# EAGLE design indoor-air-quality-shield (EAGLE 7.1.0)
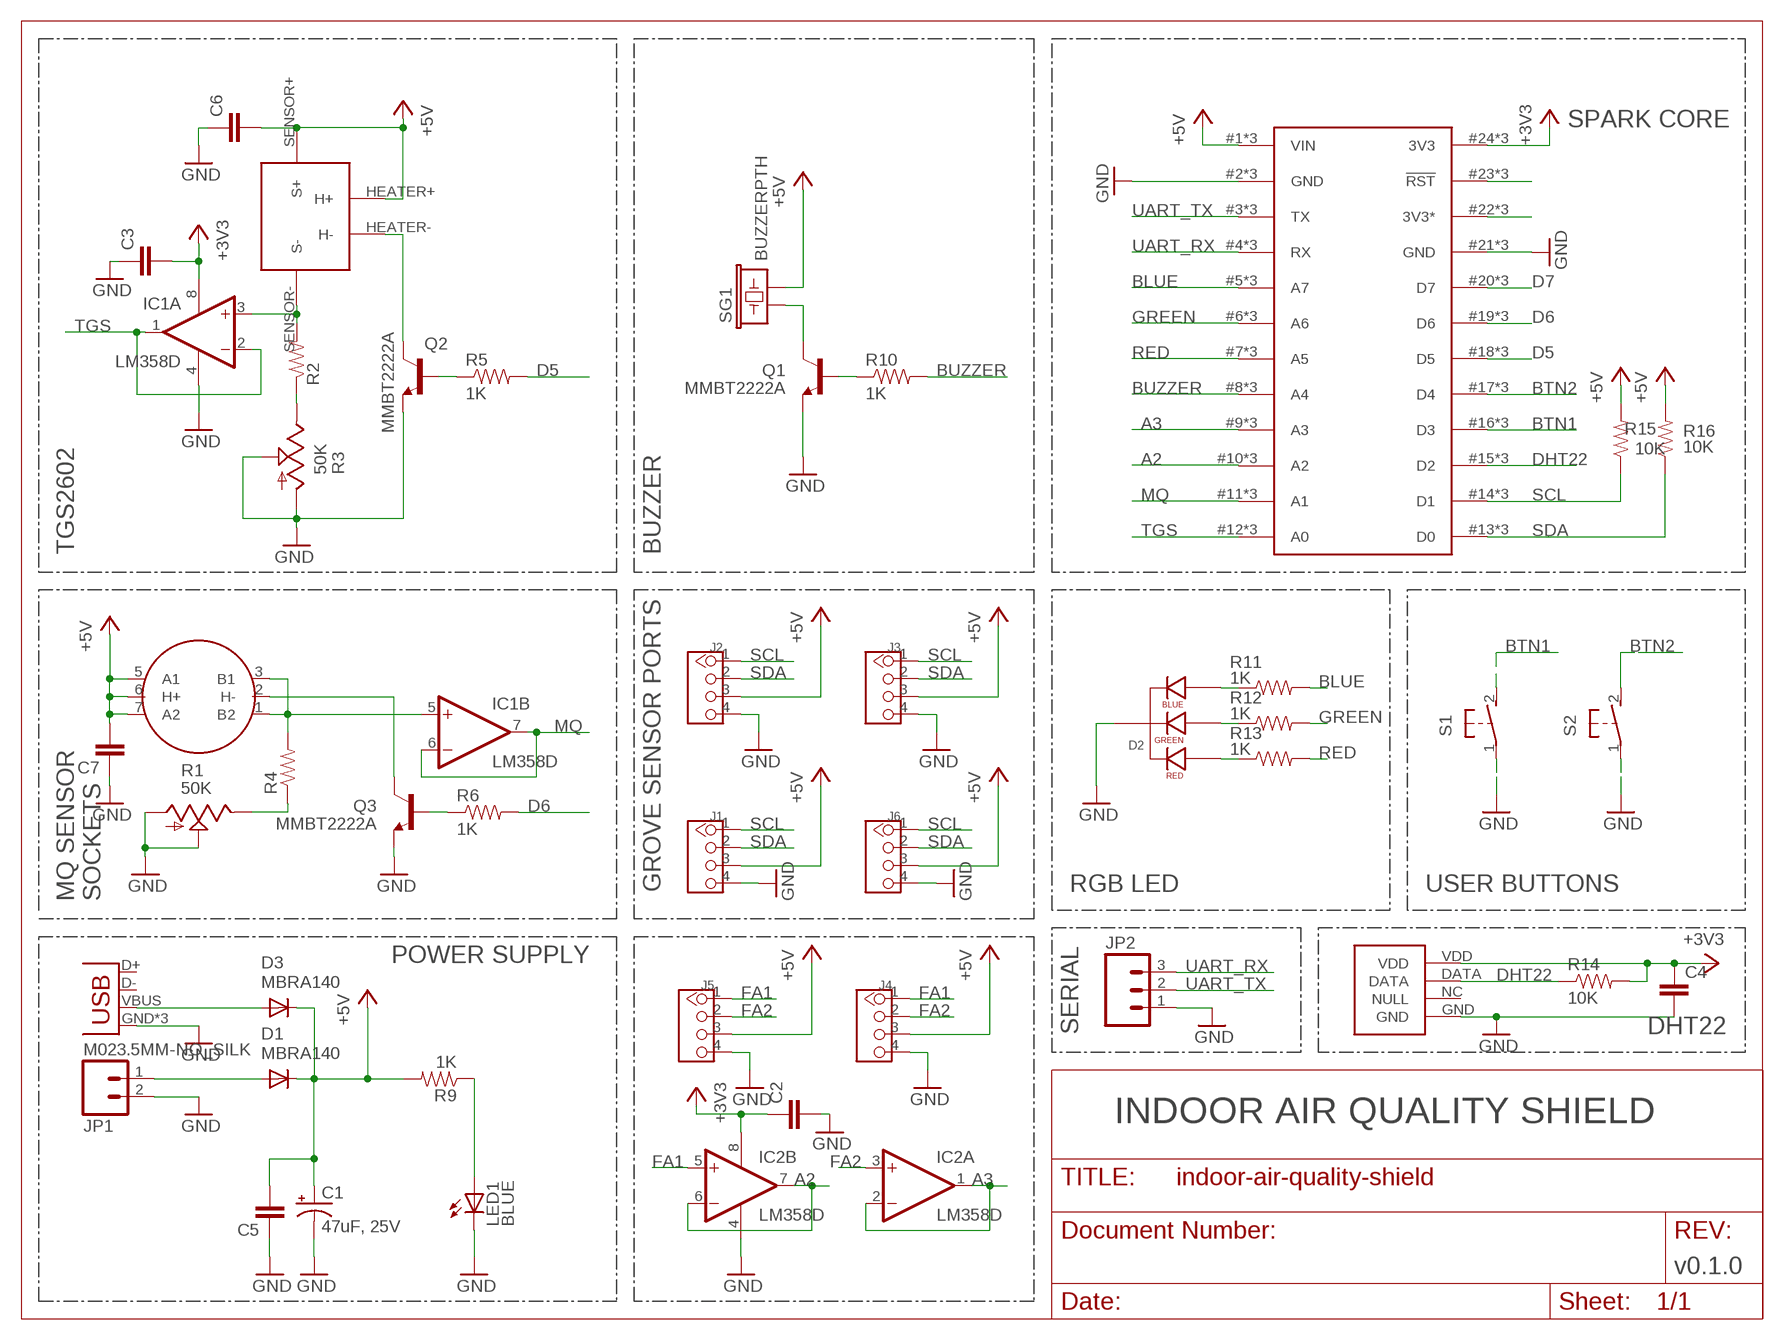
[diagram p0: schematic, sheet 1]

## Parts
C1  47uF, 25V  CAP_POLD  [PANASONIC_D]
C2  C-EUC0603  [C0603]
C3  C-EUC0603  [C0603]
C4  C-EUC0603  [C0603]
C5  C-EUC0603  [C0603]
C6  C-EUC0603  [C0603]
C7  C-EUC0603  [C0603]
D1  MBRA140  DIODESMA  [SMA-DIODE]
D2  LED-RGB-CC-THRUCLEAR  [LED-RGB-THRU]
D3  MBRA140  DIODESMA  [SMA-DIODE]
IC1  LM358D  [SO08]
IC2  LM358D  [SO08]
J1  TWIG-4P-2.0'D90'  [4P-2.0-90D-W/O-BUCKLE]
J2  TWIG-4P-2.0'D90'  [4P-2.0-90D-W/O-BUCKLE]
J3  TWIG-4P-2.0'D90'  [4P-2.0-90D-W/O-BUCKLE]
J4  TWIG-4P-2.0'D90'  [4P-2.0-90D-W/O-BUCKLE]
J5  TWIG-4P-2.0'D90'  [4P-2.0-90D-W/O-BUCKLE]
J6  TWIG-4P-2.0'D90'  [4P-2.0-90D-W/O-BUCKLE]
JP1  M023.5MM-NO_SILK  [SCREWTERMINAL-3.5MM-2-NS]
JP2  M03PTH  [1X03]
JP3  USBUSB-MICROB-SLOT-HOLE  [USB-MICROB-SLOT-HOLE]
LED1  BLUE  LED0603  [LED-0603]
Q1  MMBT2222A  TRANSISTOR_NPNMMBT2222A  [SOT23-3]
Q2  MMBT2222A  TRANSISTOR_NPNMMBT2222A  [SOT23-3]
Q3  MMBT2222A  TRANSISTOR_NPNMMBT2222A  [SOT23-3]
R1  50K  TRIM_US-RJ9W  [RJ9W]
R2  RESISTOR0603  [0603-RES]
R3  50K  TRIM_US-RJ9W  [RJ9W]
R4  RESISTOR0603  [0603-RES]
R5  1K  RESISTOR0603-RES  [0603-RES]
R6  1K  RESISTOR0603-RES  [0603-RES]
R9  1K  RESISTOR0603-RES  [0603-RES]
R10  1K  RESISTOR0603-RES  [0603-RES]
R11  1K  RESISTOR0603-RES  [0603-RES]
R12  1K  RESISTOR0603-RES  [0603-RES]
R13  1K  RESISTOR0603-RES  [0603-RES]
R14  10K  RESISTOR0603-RES  [0603-RES]
R15  10K  RESISTOR0603-RES  [0603-RES]
R16  10K  RESISTOR0603-RES  [0603-RES]
S1  31-XX  [B3F-31XX]
S2  31-XX  [B3F-31XX]
SG1  BUZZERPTH  [BUZZER-12MM]
U$1  TGS2602  [TGS2602]
U$2  MQ_SENSOR_SOCKET  [MQ_SENSOR_SOCKET]
U$5  DHT22  [DHT22]
U$6  SPARK_CORE  [SPARK_CORE_STACKABLE]

## Nets
+3V3: C2.1 C3.2 C4.1 IC1.8(P:V+) IC2.8(P:V+) R14.2 U$5.VDD U$6.24(3V3) U$6.#24(3V3) U$6.@24(3V3)
+5V: C1.+ C5.2 C6.2 C7.2 D1.C D3.C J1.3 J2.3 J3.3 J4.3 J5.3 J6.3 R9.2 R15.2 R16.2 SG1.- U$1.HEATER+(H+) U$1.SENSOR+(S+) U$2.5(A1) U$2.6(H+) U$2.7(A2) U$6.1(VIN) U$6.#1(VIN) U$6.@1(VIN)
A2: IC2.6(B:-IN) IC2.7(B:OUT) U$6.10(A2) U$6.#10(A2) U$6.@10(A2)
A3: IC2.1(A:OUT) IC2.2(A:-IN) U$6.9(A3) U$6.#9(A3) U$6.@9(A3)
BLUE: R11.2 U$6.5(A7) U$6.#5(A7) U$6.@5(A7)
BTN1: S1.2(S) U$6.16(D3) U$6.#16(D3) U$6.@16(D3)
BTN2: S2.2(S) U$6.17(D4) U$6.#17(D4) U$6.@17(D4)
BUZZER: R10.2 U$6.8(A4) U$6.#8(A4) U$6.@8(A4)
D5: R5.2 U$6.18(D5) U$6.#18(D5) U$6.@18(D5)
D6: R6.2 U$6.19(D6) U$6.#19(D6) U$6.@19(D6)
D7: U$6.20(D7) U$6.#20(D7) U$6.@20(D7)
DHT22: R14.1 U$5.DATA U$6.15(D2) U$6.#15(D2) U$6.@15(D2)
FA1: IC2.5(B:+IN) J4.1 J5.1
FA2: IC2.3(A:+IN) J4.2 J5.2
GND: C1.- C2.2 C3.1 C4.2 C5.1 C6.1 C7.1 D2.2(CATHODE) IC1.4(P:V-) IC2.4(P:V-) J1.4 J2.4 J3.4 J4.4 J5.4 J6.4 JP1.2 JP2.1 JP3.GND JP3.MT1(GND) JP3.MT2(GND) LED1.C Q1.2(E) Q2.2(E) Q3.2(E) R1.A R1.S R3.A R3.S S1.1(P) S2.1(P) U$5.GND U$6.2(GND) U$6.21(GND) U$6.#2(GND) U$6.#21(GND) U$6.@2(GND) U$6.@21(GND)
GREEN: R12.2 U$6.6(A6) U$6.#6(A6) U$6.@6(A6)
MQ: IC1.6(B:-IN) IC1.7(B:OUT) U$6.11(A1) U$6.#11(A1) U$6.@11(A1)
N$1: D2.4(BLUE_CATHODE) R11.1
N$2: D2.3(GREEN_CATHODE) R12.1
N$3: D2.1(RED_CATHODE) R13.1
N$4: R2.1 R3.E
N$5: U$6.23(!RST) U$6.#23(!RST) U$6.@23(!RST)
N$6: D1.A JP1.1
N$7: Q3.3(C) U$2.2(H-)
N$8: R1.E R4.1
N$9: U$6.22(3V3*) U$6.#22(3V3*) U$6.@22(3V3*)
N$10: D3.A JP3.VBUS
N$11: IC1.3(A:+IN) R2.2 U$1.SENSOR-(S-)
N$14: Q3.1(B) R6.1
N$15: Q1.1(B) R10.1
N$16: LED1.A R9.1
N$17: Q1.3(C) SG1.+
N$18: Q2.3(C) U$1.HEATER-(H-)
N$19: Q2.1(B) R5.1
N$23: IC1.5(B:+IN) R4.2 U$2.1(B2) U$2.3(B1)
RED: R13.2 U$6.7(A5) U$6.#7(A5) U$6.@7(A5)
SCL: J1.1 J2.1 J3.1 J6.1 R15.1 U$6.14(D1) U$6.#14(D1) U$6.@14(D1)
SDA: J1.2 J2.2 J3.2 J6.2 R16.1 U$6.13(D0) U$6.#13(D0) U$6.@13(D0)
TGS: IC1.1(A:OUT) IC1.2(A:-IN) U$6.12(A0) U$6.#12(A0) U$6.@12(A0)
UART_RX: JP2.3 U$6.4(RX) U$6.#4(RX) U$6.@4(RX)
UART_TX: JP2.2 U$6.3(TX) U$6.#3(TX) U$6.@3(TX)
Unconnected: JP3.D+ JP3.D- U$5.NC(NULL)

## Notes on the sheet
- SPARK CORE
- TGS2602 | BUZZER
- GROVE SENSOR PORTS | RGB LED | USER BUTTONS
- MQ SENSOR
  SOCKETS
- POWER SUPPLY
- SERIAL | DHT22
- INDOOR AIR QUALITY SHIELD
- v0.1.0

## Library data of the parts
C1 = SparkFun-Capacitors:CAP_POL: Capacitor Polarized These are standard SMD and PTH capacitors. Normally 10uF, 47uF, and 100uF in electrolytic and tantalum varieties. Always verify the external diameter of the through hole cap, it varies with capacity, voltage, and manufacturer. The EIA devices should be standard.
C2-C7 = rcl:C-EU: CAPACITOR, European symbol
D1 D3 = SparkFun-DiscreteSemi:DIODE: Diode These are standard reverse protection diodes and small signal diodes. SMA package can handle up to about 1A. SOD-323 can handle about 200mA. What the SOD-323 package when ordering, there are some mfgs out there that are 5-pin packages.
D2 = SparkFun-LED:LED-RGB-CC-THRU: RGB Through-hole common cathode LED SparkFun Storefront: COM-00105 (Clear) COM-09264 (Diffuse); PROD_ID: DIO-08418
IC1 IC2 = linear:LM358: OP AMP also LM158; LM258; LM2904 Source: http://cache.national.com/ds/LM/LM158.pdf
J1-J6 = Connector:TWIG-4P-2.0
JP1 = SparkFun-Connectors:M02: Standard 2-pin 0.1" header. Use with - straight break away headers ( PRT-00116) - right angle break away headers (PRT-00553) - swiss pins (PRT-00743) - machine pins (PRT-00117) - female headers (PRT-00115) Molex polarized connector foot print use with: PRT-08233 with associated crimp pins and housings. 2.54_SCREWTERM for use with PRT-10571. 3.5mm Screw Terminal footprints for PRT-08084 5mm Screw Terminal footprints for use with PRT-08433
JP2 = SparkFun-Connectors:M03: Header 3 Standard 3-pin 0.1" header. Use with straight break away headers (SKU : PRT-00116), right angle break away headers (PRT-00553), swiss pins (PRT-00743), machine pins (PRT-00117), and female headers (PRT-00115). Molex polarized connector foot print use with SKU : PRT-08232 with associated crimp pins and housings.
JP3 = Spark:USB
LED1 = SparkFun-LED:LED: LEDs Standard schematic elements and footprints for 5mm, 3mm, 1206, and 0603 sized LEDs. 5mm - Spark Fun Electronics SKU : COM-00529 (and others)
Q1-Q3 = SparkFun-DiscreteSemi:TRANSISTOR_NPN: Generic NPN BJT MMBT2222A - TRANS-08049 (SOT-23, 1A 40V) MPSA42 - TRANS-09116 (SOT-23, 500mA 300V) MMBT5088LT1G - TRANS-11160 (SOT-23, 50 mA 30V); PROD_ID: TRANS-08049
R1 R3 = pot:TRIM_US-: POTENTIOMETER
R2 R4 = SparkFun-Resistors:RESISTOR: Resistor Basic schematic elements and footprints for 0603, 1206, and PTH resistors.
R5 R6 R9-R16 = SparkFun-Passives:RESISTOR: Resistor Basic schematic elements and footprints for 0603, 1206, and PTH resistors.
S1 S2 = switch-omron:31-XX: OMRON SWITCH; MPN: B3F-3100; OC_FARNELL: 959704; OC_NEWARK: 36M3582
SG1 = SparkFun-Electromechanical:BUZZER: Buzzer 12mm Spark Fun Electronics SKU : Comp-Buzzer
U$1 = Spark:TGS2602
U$2 = Spark:MQ_SENSOR_SOCKET
U$5 = Spark:DHT22
U$6 = Spark:SPARK_CORE

## Board
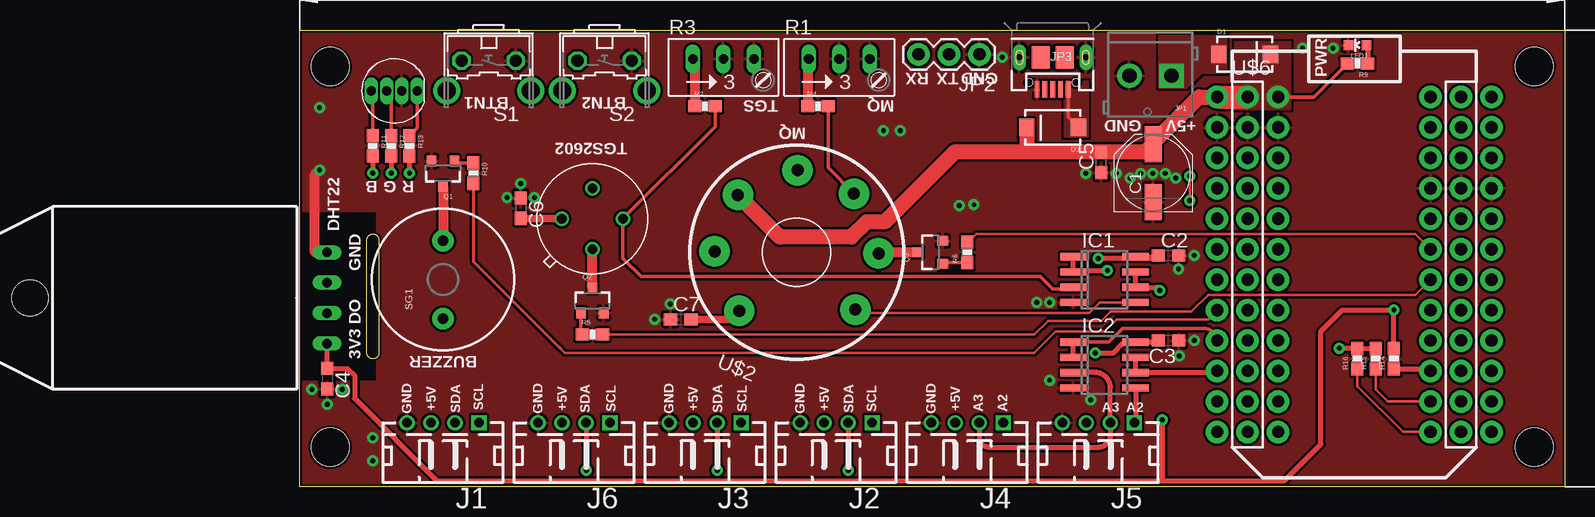
[diagram p1: board, top side]
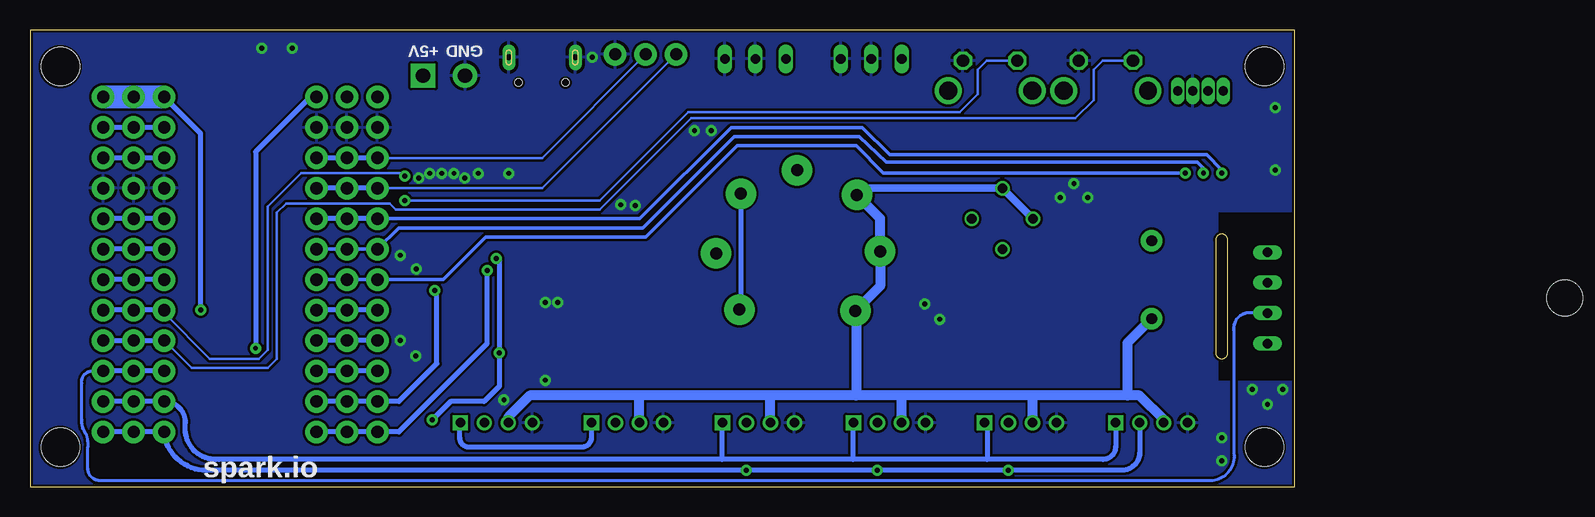
[diagram p2: board, bottom side, seen from below]

Size 105.41 x 38.1 mm. Coordinates in mm from the lower left corner, seen from the top.
Outline: 105.41,38.1 105.41,0 0,0 0,38.1 105.41,38.1
Outline: 5.59,11.18 5.59,20.57 arc-90 6.1,21.08 arc-90 6.6,20.57 6.6,11.18 arc-90 6.1,10.67 arc-90 5.59,11.18
Copper layers (1*16): Top 0.035mm / dielectric 1.5mm / Bottom 0.035mm
Design rules "SparkFun-2-layer *": minimum track width 7mil, minimum drill 15mil, track to track 8mil, track to pad 8mil, pad to pad 8mil, via to via 8mil, smd to smd 8mil, copper to edge 8mil, drill to drill 8mil, minimum pad ring 6mil, minimum via ring 10mil, stop-mask expansion 4mil, vias tented up to drill 20mil, thermal gap 10mil
Holes 3.17 mm at 2.54,35.05 102.87,3.3 2.54,3.3 102.87,35.05
tRestrict: area 0,8.9 to 6.3,22.9
bRestrict: area 0,8.9 to 6.3,22.9

### Footprints (pad centres in the part's own frame; a part is rotated, then mirrored left to right if it is on the bottom)
PANASONIC_D = smd 3 x 1.4: + 2.4,0; - -2.4,0
C0603 = smd 1.1 x 1: 1 -0.85,0; 2 0.85,0
SMA-DIODE = smd 1.27 x 1.47: A -2.15,0; C 2.15,0
LED-RGB-THRU = drill 0.762 pad 0.889 long: 1 1.905,0; 2 0.635,0; 3 -0.635,0; 4 -1.905,0
SO08 = smd 0.6 x 2.2: 1 -1.905,-2.6; 2 -0.635,-2.6; 3 0.635,-2.6; 4 1.905,-2.6; 5 1.905,2.6; 6 0.635,2.6; 7 -0.635,2.6; 8 -1.905,2.6
4P-2.0-90D-W/O-BUCKLE = drill 0.8 pad 1.27 square: 1 -3,0 | drill 0.8 pad 1.27: 2 -1,0; 3 1,0; 4 3,0
SCREWTERMINAL-3.5MM-2-NS = drill 1.2 pad 2.032 square: 1 0,0 | drill 1.2 pad 2.032: 2 3.5,0
1X03 = drill 1.016 pad 1.88: 1 0,0; 2 2.54,0; 3 5.08,0
USB-MICROB-SLOT-HOLE = smd 0.4 x 1.35: D+ 0,2.675; D- -0.65,2.675; GND 1.3,2.675; ID 0.65,2.675; VBUS -1.3,2.675 | drill 0.5 pad 1.1 long: MT1 -2.775,0; MT2 2.775,0 | smd 1.5 x 1.9: P$1 -1,0; P$2 1,0.01 | hole 0.6: -1.95,2.1; 1.95,2.1
LED-0603 = smd 0.8 x 0.8: A 0,-0.75; C 0,0.75
SOT23-3 = smd 0.8 x 0.9: 1 -0.95,-1; 2 0.95,-1; 3 0,1.1
RJ9W = drill 0.813 long: A 2.54,0.635; E -2.54,0.635; S 0,0.635
0603-RES = smd 1.1 x 1: 1 -0.85,0; 2 0.85,0
B3F-31XX = drill 1.016 octagon: 1 -2.261,-1.245; 2 2.261,-1.245 | drill 1.499 pad 2.159: 3 -3.505,1.245; 4 3.505,1.245
BUZZER-12MM = drill 0.9 pad 1.778: + 3.25,0; - -3.25,0
TGS2602 = drill 0.8: HEATER+ 2.55,0; HEATER- 0,2.55; SENSOR+ 0,-2.55; SENSOR- -2.55,0
MQ_SENSOR_SOCKET = drill 1 pad 2.54: 1 6.35,-2.54; 2 6.35,2.54; 3 2.54,6.35; 4 -2.54,6.35; 5 -6.35,2.54; 6 -6.35,-2.54; 7 -2.54,-6.35
DHT22 = drill 0.8 long: DATA -1.27,0; GND 3.81,0; NC 1.27,0; VDD -3.81,0 | hole 3: 0,24.765
SPARK_CORE_STACKABLE = drill 1.016 pad 1.88: 1 -8.89,13.97; 2 -8.89,11.43; 3 -8.89,8.89; 4 -8.89,6.35; 5 -8.89,3.81; 6 -8.89,1.27; 7 -8.89,-1.27; 8 -8.89,-3.81; 9 -8.89,-6.35; 10 -8.89,-8.89; 11 -8.89,-11.43; 12 -8.89,-13.97; 13 8.89,-13.97; 14 8.89,-11.43; 15 8.89,-8.89; 16 8.89,-6.35; 17 8.89,-3.81; 18 8.89,-1.27; 19 8.89,1.27; 20 8.89,3.81; 21 8.89,6.35; 22 8.89,8.89; 23 8.89,11.43; 24 8.89,13.97; #1 -6.35,13.97; #2 -6.35,11.43; #3 -6.35,8.89; #4 -6.35,6.35; #5 -6.35,3.81; #6 -6.35,1.27; #7 -6.35,-1.27; #8 -6.35,-3.81; #9 -6.35,-6.35; #10 -6.35,-8.89; #11 -6.35,-11.43; #12 -6.35,-13.97; #13 11.43,-13.97; #14 11.43,-11.43; #15 11.43,-8.89; #16 11.43,-6.35; #17 11.43,-3.81; #18 11.43,-1.27; #19 11.43,1.27; #20 11.43,3.81; #21 11.43,6.35; #22 11.43,8.89; #23 11.43,11.43; #24 11.43,13.97; @1 -11.43,13.97; @2 -11.43,11.43; @3 -11.43,8.89; @4 -11.43,6.35; @5 -11.43,3.81; @6 -11.43,1.27; @7 -11.43,-1.27; @8 -11.43,-3.81; @9 -11.43,-6.35; @10 -11.43,-8.89; @11 -11.43,-11.43; @12 -11.43,-13.97; @13 6.35,-13.97; @14 6.35,-11.43; @15 6.35,-8.89; @16 6.35,-6.35; @17 6.35,-3.81; @18 6.35,-1.27; @19 6.35,1.27; @20 6.35,3.81; @21 6.35,6.35; @22 6.35,8.89; @23 6.35,11.43; @24 6.35,13.97

### Placement (x,y rotation side)
C1  71.12,26.16 90 top
C2  72.39,19.3 0 top
C3  72.39,12.19 180 top
C4  2.29,9.02 270 top
C5  66.8,27.05 90 top
C6  18.41,23.24 270 top
C7  31.75,13.97 0 top
D1  78.74,36.07 0 top
D2  7.87,33.02 0 top
D3  62.74,29.97 180 top
IC1  67.06,17.27 270 top
IC2  67.06,10.16 270 top
J1  11.94,5.33 180 top
J2  44.7,5.33 180 top
J3  33.78,5.33 180 top
J4  55.63,5.33 180 top
J5  66.55,5.33 180 top
J6  22.86,5.33 180 top
JP1  72.64,34.29 180 top
JP2  56.64,36.07 180 top
JP3  62.74,35.81 180 top
LED1  88.14,36.83 90 top
Q1  11.94,26.16 180 top
Q2  24.38,15.49 0 top
Q3  52.58,19.56 90 top
R1  44.96,35.05 0 top
R2  33.78,31.75 0 top
R3  35.31,35.05 0 top
R4  43.18,31.75 0 top
R5  24.38,12.7 0 top
R6  55.63,19.56 90 top
R9  88.14,35.31 180 top
R10  14.48,26.16 270 top
R11  6.1,28.45 270 top
R12  7.62,28.45 270 top
R13  9.14,28.45 270 top
R14  91.19,10.67 90 top
R15  89.66,10.67 90 top
R16  88.14,10.67 90 top
S1  15.75,34.29 180 top
S2  25.4,34.29 180 top
SG1  11.94,17.27 90 top
U$1  24.38,22.35 180 top
U$2  41.4,19.56 337.5 top
U$3  [SPARK_LOGO2]  86.74,17.4 0 top
U$5  2.29,15.75 90 top
U$6  87.88,18.54 0 top

### Tracks (layer width: path | path; a pad name or v marks a point on that pad's centre or on a via)
+3V3  (via drill 0.41)
  Top 0.406: C3.2 arc-90 71.41,12.06 IC2.8 69.53,11.94 68.58,11.94 67.82,11.18 v66.29,11.18 | IC1.8 71.41,19.18 arc90 C2.1 arc-90 71.29,19.05 v66.55,19.05 | R14.2 v91.19,14.73 86.87,14.73 85.09,12.95 85.09,3.56 82.04,0.51 71.88,0.51 | 71.88,0.51 11.43,0.51 4.57,7.37 4.57,9.27 3.98,9.87 C4.1 U$5.VDD | v71.88,5.59 71.88,0.51
  Bottom 0.406: v66.55,19.05 arc90 66.29,18.8 v66.29,11.18 66.29,8.38 67.56,7.11 70.36,7.11 v71.88,5.59 | v91.19,14.73 91.19,29.46 U$6.@24
  Bottom 1.93: U$6.@24 U$6.24 U$6.#24
+5V  (via drill 0.41)
  Top 0.305: U$6.#1 84.49,32.51 R9.2
  Top 0.406: R15.2 R16.2 86.91,11.52 v86.61,11.56 | C5.2 69.56,27.9 69.6,27.94
  Top 0.61: C6.2 21.8,22.39 U$1.HEATER+ | C7.2 35.93,13.97 U$2.7
  Top 1.27: U$6.@1 74.93,32.51 71.12,28.7 C1.+ 70.5,27.94 69.6,27.94 60.45,27.94 | 60.45,27.94 54.61,27.94 48.77,22.1 47.24,22.1 45.97,20.83 40.01,20.83 U$2.5 | D3.C 60.59,28.08 60.45,27.94
  Top 1.93: U$6.@1 U$6.1
  Bottom 0.406: U$6.#1 82.04,32.51 86.61,27.94 v86.61,11.56
  Bottom 0.61: U$1.HEATER+ U$1.SENSOR+ 35.94,24.9 U$2.5
  Bottom 0.813: 13.97,7.62 12.95,7.62 10.94,5.6 J1.3 | 13.97,7.62 22.1,7.62 | 22.1,7.62 32.51,7.62 | 32.51,7.62 36.58,7.62 | 36.58,7.62 43.69,7.62 | 43.69,7.62 54.61,7.62 | 54.61,7.62 63.75,7.62 65.55,5.83 J5.3 arc-90 65.53,5.35 | J6.3 21.86,7.38 arc-90 22.1,7.62 | J3.3 32.78,7.35 arc90 32.51,7.62 | J4.3 54.63,7.6 arc90 54.61,7.62 | J2.3 43.7,7.6 arc90 43.69,7.62 | 13.97,7.62 13.97,11.99 SG1.- | 36.58,7.62 36.58,14.61 arc-90 U$2.7 34.56,16.73 U$2.6 34.56,22.39 U$2.5
  pour Top (no thermals): 82.55,37.08 77.98,37.08 77.98,31.5 82.55,31.5
A2
  Top 0.406: IC2.7 IC2.6 76.33,9.53 arc90 U$6.@10
  Bottom 0.406: U$6.@10 U$6.10 U$6.#10
A3
  Top 0.305: U$6.@9 arc90 75.18,13.21 68.58,13.21 67.44,12.06 IC2.1
  Top 0.406: IC2.2 IC2.1
  Bottom 0.406: U$6.@9 U$6.9 U$6.#9
BLUE  (via drill 0.41)
  Top 0.406: R11.2 v6.1,26.16
  Bottom 0.305: v6.1,26.16 6.1,26.42 7.37,27.69 33.78,27.69 36.07,29.97 46.99,29.97 54.61,22.35 U$6.@5
  Bottom 0.406: U$6.@5 U$6.5 U$6.#5
BTN1
  Bottom 0.203: S1.2 16.03,35.53 16.76,34.8 16.76,32.26 18.29,30.73 50.29,30.73 57.91,23.11 74.93,23.11 75.44,23.62 84.07,23.62 84.84,22.86 84.84,10.67 85.6,9.91 91.95,9.91 U$6.@16
  Bottom 0.406: U$6.#16 U$6.16 U$6.@16
BTN2  (via drill 0.41)
  Top 0.203: v74.17,23.88 v74.17,25.91
  Bottom 0.203: S2.2 25.68,35.53 26.42,34.8 26.42,32.77 27.94,31.24 50.55,31.24 57.91,23.88 v74.17,23.88 | U$6.@17 94.23,14.48 90.42,10.67 86.36,10.67 85.6,11.43 85.6,23.37 82.8,26.16 74.42,26.16 v74.17,25.91
  Bottom 0.406: U$6.@17 U$6.17 U$6.#17
BUZZER
  Top 0.203: 21.72,11.56 22.1,11.18 61.21,11.18 62.99,12.95 67.06,12.95 68.07,13.97 75.69,13.97 U$6.@8
  Top 0.254: R10.2 14.48,18.8 21.72,11.56
  Bottom 0.406: U$6.@8 U$6.8 U$6.#8
D5
  Top 0.203: R5.2 61.21,12.7 62.36,13.84 66.8,13.84 67.56,14.61 74.3,14.61 75.69,16 92.96,16 U$6.@18
  Bottom 0.406: U$6.@18 U$6.18 U$6.#18
D6
  Top 0.203: R6.2 55.71,20.41 56.39,21.08 92.96,21.08 U$6.@19
  Bottom 0.406: U$6.@19 U$6.19 U$6.#19
D7
  Bottom 0.406: U$6.@20 U$6.20 U$6.#20
DHT22
  Top 0.406: R14.1 94.07,9.82 arc-90 U$6.@15
  Bottom 0.254: U$5.DATA 4.06,14.48 arc-90 5.08,12.95 5.08,2.79 arc90 6.86,0.51 99.57,0.51 arc90 100.58,1.52 100.58,3.3 arc-37 100.84,4.57 arc37 101.09,5.59 101.09,8.64 arc90 100.33,9.65 U$6.#15
  Bottom 0.406: U$6.@15 U$6.15 U$6.#15
FA1
  Top 0.406: IC2.5 69.66,5.44 arc-90 J5.1
  Bottom 0.406: J4.1 58.63,4.11 arc90 59.44,3.3 68.83,3.3 arc90 69.6,4.06 69.6,5.29 arc90 J5.1
FA2
  Top 0.406: J4.2 56.63,4.08 arc90 57.4,3.3 66.55,3.3 arc90 67.56,4.32 67.56,5.32 arc90 J5.2 67.55,8.27 arc90 66.29,9.53 IC2.3
GND  (via drill 0.41)
  Top 0.813: U$5.GND 1.27,19.56 1.27,26.04 v1.65,26.42
  other vias: 74.55,19.3 73.28,10.92 62.48,15.37 62.48,8.89 74.55,12.19 73.23,18.16 3.56,8.13 1.02,8.13 6.1,2.16 6.1,4.06 1.65,31.62 86.11,36.58 83.57,36.58 58.55,35.81 48.64,29.72 50.04,29.72 56.18,23.52 54.97,23.47 65.91,7.24 61.42,15.37 2.29,6.86 17.27,24.13 19.56,24.13 18.41,25.27 29.59,13.97 30.86,15.24 71.09,26.14 72.11,26.14 73,25.76 70.08,26.14 69.19,25.76 68.05,26.14 65.51,26.14
  pour Top (rank 2): 0,0 105.41,0 105.41,38.1 0,38.1
  pour Bottom (rank 2): 0,0 105.41,0 105.41,38.1 0,38.1
GREEN  (via drill 0.41)
  Top 0.406: R12.2 v7.62,26.16
  Bottom 0.305: U$6.#6 U$6.6 U$6.@6 74.68,21.59 54.36,21.59 46.74,29.21 36.32,29.21 34.04,27.08 8.13,27.08 7.62,26.57 v7.62,26.16
MQ  (via drill 0.41)
  Top 0.406: IC1.7 IC1.6 71.4,16.64 v71.68,16.36
  Bottom 0.406: U$6.#11 U$6.11 U$6.@11 74.68,7.11 71.5,10.29 71.5,16.18 v71.68,16.36
N$1
  Top 0.305: D2.4 6.1,32.89 R11.1
N$2
  Top 0.305: D2.3 7.62,32.64 R12.1
N$3
  Top 0.305: D2.1 9.78,29.93 R13.1
N$4
  Top 0.813: R3.E 32.93,35.52 R2.1
N$5
  Bottom 0.406: U$6.@23 U$6.23 U$6.#23
N$6
  pour Top (no thermals): 71.63,33.27 71.63,37.59 77.22,37.59 77.22,34.54 75.18,34.54 73.91,33.27
N$7
  Top 0.813: Q3.3 48.32,19.56 arc90 U$2.2
N$8
  Top 0.813: R1.E 42.33,35.6 R4.1
N$9
  Bottom 0.406: U$6.@22 U$6.22 U$6.#22
N$10
  Top 0.305: JP3.VBUS 64.04,30.82 D3.A
  pour Top (no thermals): 63.75,33.78 63.75,29.21 65.66,29.21 65.66,33.78
N$11
  Top 0.305: R2.2 34.63,30.05 U$1.SENSOR- 26.93,19.04 28.45,17.53 61.72,17.53 62.74,16.51 64.33,16.51 IC1.3
N$14
  Top 0.305: R6.1 53.68,18.71 Q3.1
N$15
  Top 0.305: R10.1 13.04,27.01 Q1.1
N$16
  Top 0.406: LED1.A 88.99,36.73 R9.1
N$17
  Top 0.813: Q1.3 SG1.+
N$18
  Top 0.813: Q2.3 U$1.HEATER-
N$19
  Top 0.305: Q2.1 23.43,12.8 R5.1
N$23
  Top 0.203: U$2.1 arc90 46.6,14.48 65.79,14.48 66.67,15.37 IC1.5
  Top 0.305: R4.2 44.03,26.6 U$2.3
  Bottom 0.406: U$2.3 46.18,14.9 U$2.1
RED  (via drill 0.41)
  Top 0.406: R13.2 v9.14,26.16
  Bottom 0.305: U$6.#7 U$6.7 U$6.@7 70.99,17.27 67.44,20.83 54.1,20.83 46.48,28.45 36.58,28.45 34.29,26.16 v9.14,26.16
SCL
  Top 0.203: R15.1 89.66,8.13 90.68,7.11 U$6.@14
  Bottom 0.406: J1.1 14.94,3.35 arc90 16,2.29 25.65,2.29 | 25.65,2.29 36.83,2.29 | 36.83,2.29 47.75,2.29 | 47.75,2.29 89.66,2.29 arc90 92.46,4.57 92.46,5.33 arc-90 U$6.@14 U$6.14 U$6.#14 | J6.1 25.65,5.33 25.65,2.29 | J3.1 36.83,5.33 36.83,2.29 | J2.1 47.75,5.33 47.75,2.29
SDA  (via drill 0.41)
  Top 0.203: U$6.@13 91.95,4.57 88.14,8.38 R16.1
  Top 0.406: J2.2 v45.72,1.37 | J6.2 23.88,5.33 v23.88,1.37 | J3.2 34.8,5.33 v34.8,1.37
  Bottom 0.406: J1.2 12.94,2.81 arc90 14.48,1.37 v23.88,1.37 v34.8,1.37 v45.72,1.37 90.37,1.37 arc90 U$6.@13 U$6.13 U$6.#13
TGS  (via drill 0.41)
  Top 0.406: IC1.1 IC1.2 arc-90 64.58,18.03 v67.31,18.03
  Bottom 0.406: U$6.#12 U$6.12 U$6.@12 74.68,4.57 67.31,11.94 v67.31,18.03
UART_RX
  Bottom 0.203: U$6.@4 62.74,24.89 JP2.3
  Bottom 0.406: U$6.@4 U$6.4 U$6.#4
UART_TX
  Bottom 0.203: U$6.@3 62.74,27.43 JP2.2
  Bottom 0.406: U$6.#3 U$6.3 U$6.@3

### Text on the board
tPlace: PWR | RX | TX | GND | BTN1 | BTN2 | TGS | MQ | MQ | GND | +5V | TGS2602 | B | G | R | DHT22 | GND | DO | 3V3 | BUZZER | GND | +5V | SDA | SCL | GND | +5V | SDA | SCL | GND | +5V | SDA | SCL | GND | +5V | SDA | SCL | GND | +5V | A3 | A2 | A3 | A2
bPlace: GND | +5V | spark.io
tOrigins: 1 | 2 | 3 | 4 | 5 | 6
tStop: AIR QUALITY SHIELD